# EAGLE design uc4h gpsmagbaro ws2812 v0100 (EAGLE 7.5.0)
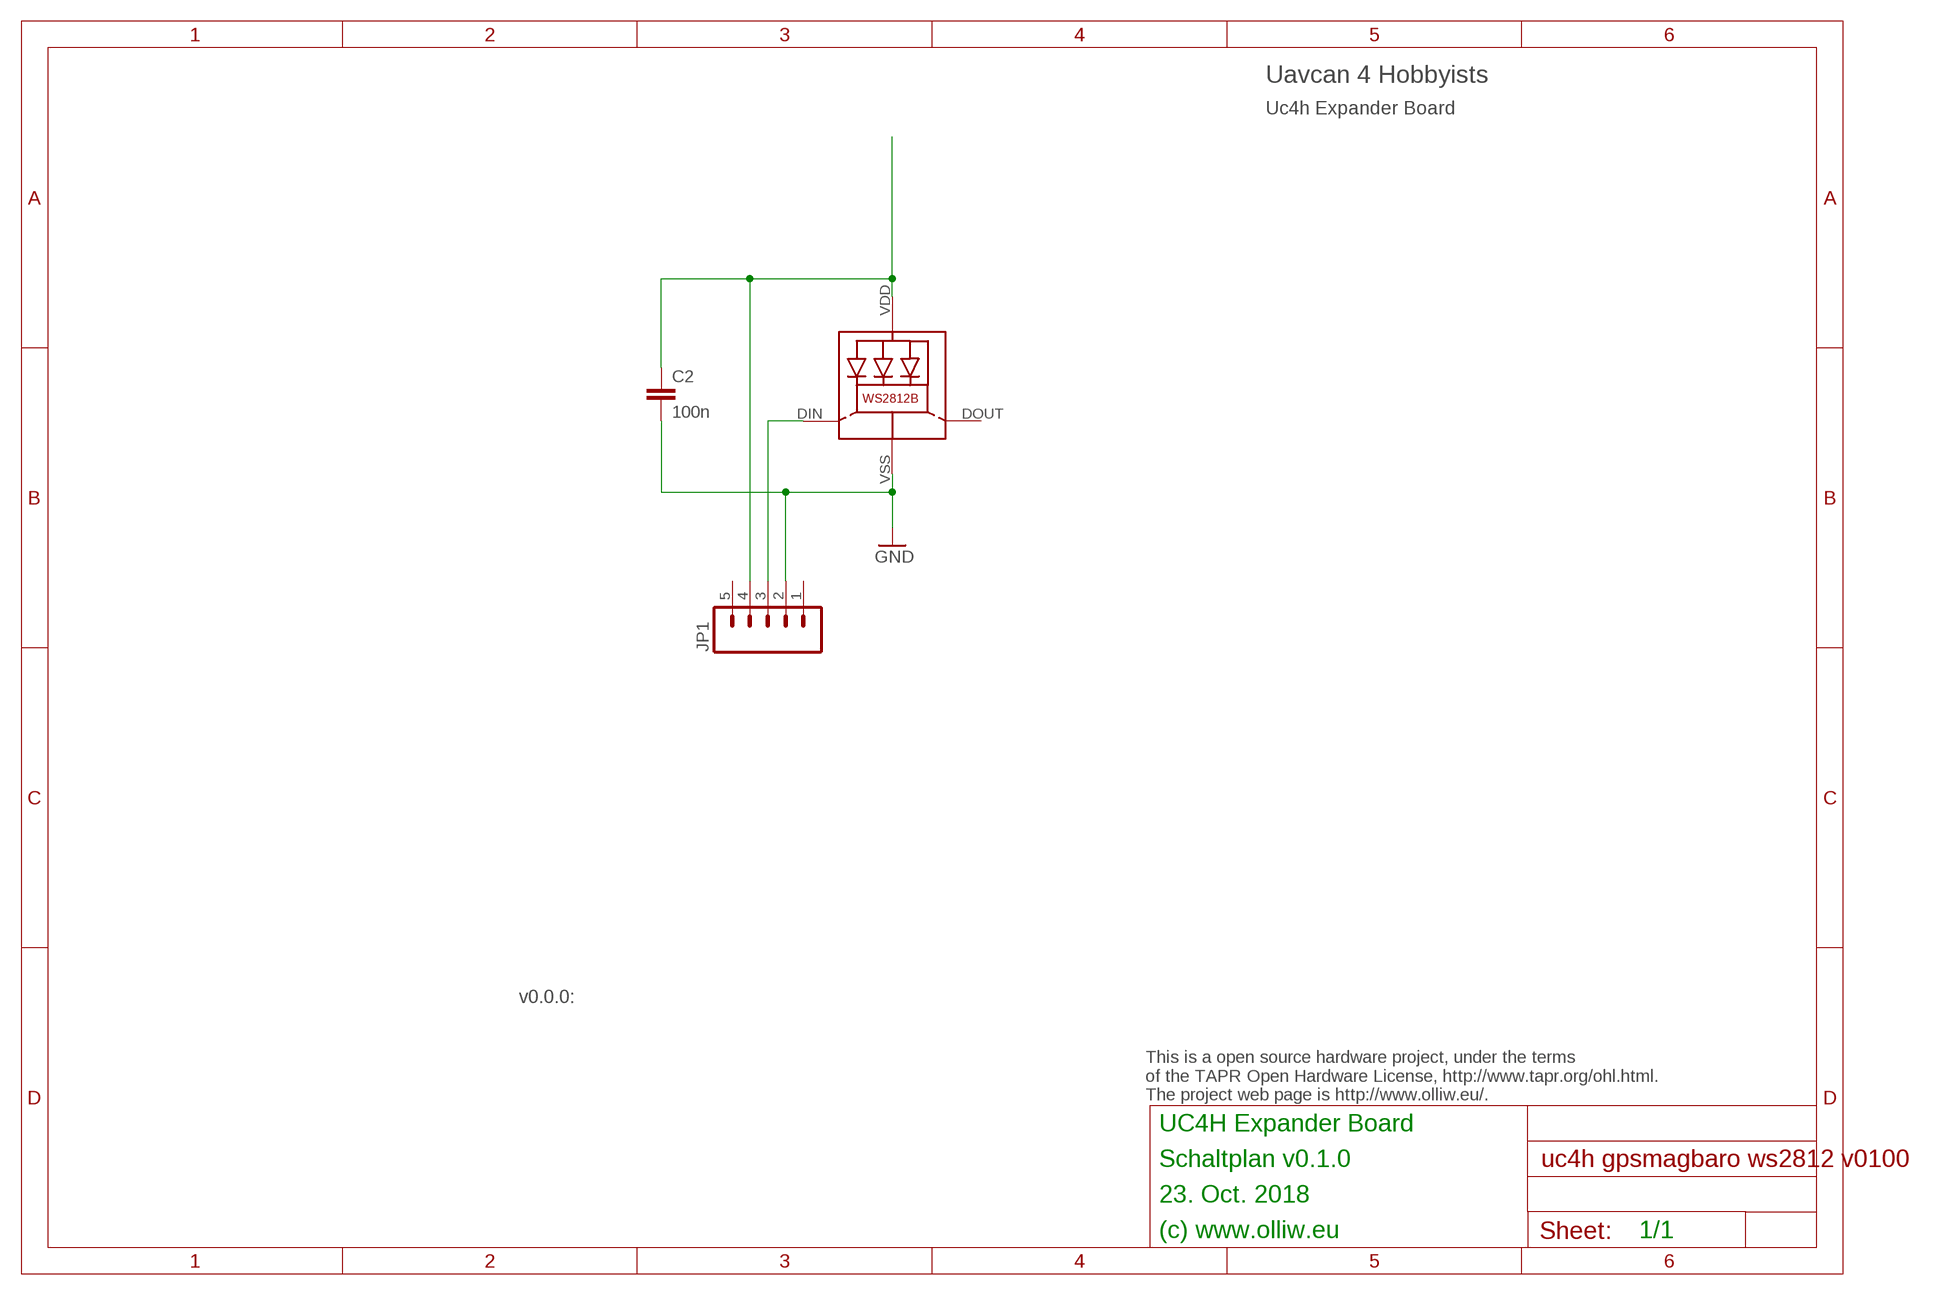
[diagram p0: schematic, sheet 1]

## Parts
C2  100n  C-EUC0402  [C0402]
JP1  M05PTH  [1X05]
LED1  WS2812B  [WS2812B]

## Nets
GND: C2.2 JP1.2 LED1.VSS(GND)
N$1: JP1.3 LED1.DIN(DI)
N$2: C2.1 JP1.4 LED1.VDD
Unconnected: JP1.1 JP1.5 LED1.DOUT(DO)

## Notes on the sheet
- Uavcan 4 Hobbyists
- Uc4h Expander Board
- v0.0.0:
- This is a open source hardware project, under the terms
  of the TAPR Open Hardware License, http://www.tapr.org/ohl.html.
  The project web page is http://www.olliw.eu/.
- UC4H Expander Board
- Schaltplan v0.1.0
- 23. Oct. 2018
- (c) www.olliw.eu | 1/1

## Library data of the parts
C2 = rcl:C-EU: CAPACITOR, European symbol
JP1 = # SparkFun2:M05: Header 5 Standard 5-pin 0.1" header. Use with straight break away headers (SKU : PRT-00116), right angle break away headers (PRT-00553), swiss pins (PRT-00743), machine pins (PRT-00117), and female headers (PRT-00115). Molex polarized connector foot print use with SKU : PRT-08230 with associated crimp pins and housings.
LED1 = WS2812B:WS2812B: Features and Benefits  * Intelligent reverse connect protection, the power supply reverse connection does not damage the IC. * The control circuit and the LED share the only power source. Control circuit and RGB chip are integrated in a package of 5050 components, form a complete control of pixel point.  * Built-in signal reshaping circuit, after wave reshaping to the next driver, ensure wave-form distortion not accumulate.  * Built-in electric reset circuit and power lost reset circuit.  * Each pixel of the three primary color can achieve 256 brightness display, completed 16777216 color full color display, and scan frequency not less than 400Hz/s.  * Cascading port transmission signal by single line.  * Any two point the distance more than 5m transmission signal without any increase circuit.  * When the refresh rate is 30fps, cascade number are not less than1024 points.  * Send data at speeds of 800Kbps.  *The color of the light were highly consistent, cost-effective. Applications  Full-color module, Full color soft lights a lamp strip. LED decorative lighting, Indoor/outdoor LED video irregular screen. General description WS2812B is a intelligent control LED light source that the control circuit and RGB chip are integrated in a package of 5050 components. It internal include intelligent digital port data latch and signal reshaping amplification drive circuit. Also include a precision internal oscillator and a 12V voltage programmable constant curre-nt control part, effectively ensuring the pixel point light color height consistent. The data transfer protocol use single NZR communication mode. After the pixel power-on reset, the DIN port receive data from controller, the first pixel collect initial 24bit data then sent to the internal data latch, the other data which reshaping by the internal signal reshaping amplification circuit sent to the next cascade pixel through the DO port. After transmission for each pixel,the signal to reduce 24bit. pixel adopt auto reshaping transmit technology, making the pixel cascade number is not limited the signal transmission, only depend on the speed of signal transmission. LED with low driving voltage, environmental protection and energy saving, high brightness, scattering angle is large, good consistency, low power, long life and other advantages. The control chip integrated in LED above becoming more simple circuit, small volume, convenient installation. Absolute Maximum Ratings Power supply voltage: VDD +3.5V..+5.3V Input voltage: VI -0.5V..VDD+0.5V based on WS2812 from https://github.com/adafruit/Adafruit-Eagle-Library

## Board
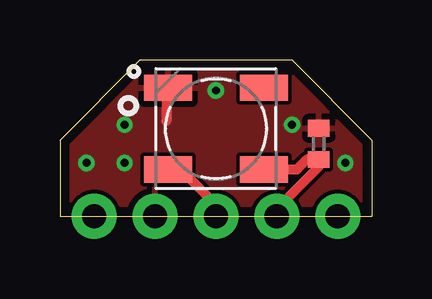
[diagram p1: board, top side]
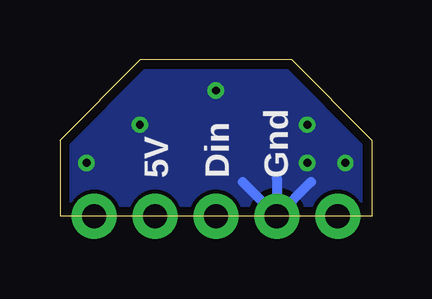
[diagram p2: board, bottom side, seen from below]

Size 13.02 x 6.51 mm. Coordinates in mm from the lower left corner, seen from the top.
Outline: 0,0 13.02,0 13.02,3.17 9.68,6.51 3.33,6.51 0,3.17 0,0
Copper layers (1*16): Top 0.0356mm / dielectric 1.5011mm / Bottom 0.0356mm
Design rules "ow-oshpark-2layer": minimum track width 6mil, minimum drill 13mil, track to track 6mil, track to pad 6mil, pad to pad 6mil, via to via 6mil, smd to smd 6mil, copper to edge 15mil, drill to drill 6mil, minimum pad ring 7mil, minimum via ring 7mil, stop-mask expansion 2.5mil, vias tented up to drill 26mil, thermal gap 10mil

### Footprints (pad centres in the part's own frame; a part is rotated, then mirrored left to right if it is on the bottom)
C0402 = smd 0.7 x 0.9: 1 -0.65,0; 2 0.65,0
1X05 = drill 1.016 pad 1.88: 1 0,0; 2 2.54,0; 3 5.08,0; 4 7.62,0; 5 10.16,0
WS2812B = smd 2 x 1.1: DIN 2,1.7; DOUT -2,-1.7; VDD -2,1.7; VSS 2,-1.7

### Placement (x,y rotation side)
C2  10.79,3.02 90 top
JP1  1.43,0 0 top
LED1  6.51,3.65 180 top

### Tracks (layer width: path | path; a pad name or v marks a point on that pad's centre or on a via)
GND  (via drill 0.33)
  Top 0.406: 4.44,5.56 4.44,3.97
  Bottom 0.406: 5.4,1.43 JP1.2 | 2.54,1.43 JP1.2 | 3.97,1.59 JP1.2
  other vias: 6.51,5.24 2.7,3.81 2.7,2.22 9.68,3.81 11.91,2.22 1.11,2.22
  pour Bottom (isolate 0.152, rank 6): -0.63,7.3 13.65,7.3 13.65,-0.16 -0.63,-0.16
  pour Top (isolate 0.152, rank 6): -0.63,7.3 13.65,7.3 13.65,-0.16 -0.63,-0.16
N$1
  Top 0.406: JP1.3 6.51,0.48 5.03,1.95 LED1.DIN
N$2
  Top 0.406: JP1.4 9.05,0.32 10.79,2.06 C2.1 10.3,2.37 9.89,1.95 LED1.VDD

### Text on the board
bNames: Gnd | Din | 5V